# EAGLE design solar (EAGLE 9.1.3)
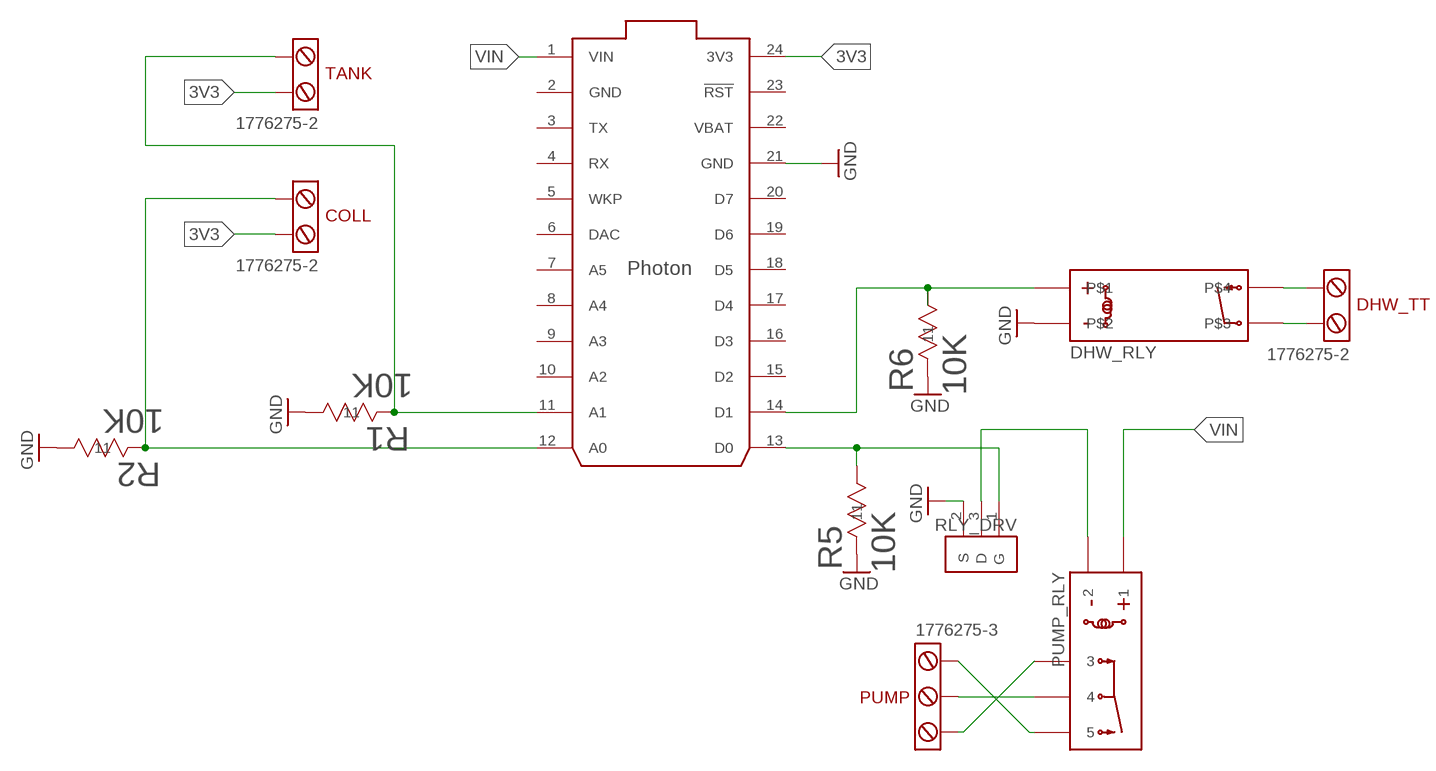
[diagram p0: schematic, sheet 1]

## Parts
COLL  1776275-2  [TERM-BLOCK-3.5MM-2]
DHW_RLY  CPC1017N  [SOP04]
DHW_TT  1776275-2  [TERM-BLOCK-3.5MM-2]
PARTICLE  PHOTON_WITH_HEADERS  [PHOTON]
PUMP  1776275-3  [TERM-BLOCK-3.5MM-3]
PUMP_RLY  PE014005  [RELAY5-PE_CO]
R1  10K  ERA-6ARW103V0805-M  [0805-M]
R2  10K  ERA-6ARW103V0805-M  [0805-M]
R5  10K  ERA-6ARW103V0805-M  [0805-M]
R6  10K  ERA-6ARW103V0805-M  [0805-M]
RLY_DRV  NTR4003N  [SOT23]
TANK  1776275-2  [TERM-BLOCK-3.5MM-2]

## Nets
3V3: COLL.P$1 PARTICLE.24(3V3) TANK.P$1
A0: COLL.P$2 PARTICLE.12(A0) R2.1
A1: PARTICLE.11(A1) R1.1 TANK.P$2
COM [5A]: PUMP.P$2 PUMP_RLY.11
D0: PARTICLE.13(D0) R5.2 RLY_DRV.1(G)
D1: DHW_RLY.P$1 PARTICLE.14(D1) R6.2
GND: DHW_RLY.P$2 PARTICLE.21(GND) R1.2 R2.2 R5.1 R6.1 RLY_DRV.2(S)
N$7: PUMP_RLY.A2 RLY_DRV.3(D)
N$8: DHW_RLY.P$4 DHW_TT.P$2
N$10: DHW_RLY.P$3 DHW_TT.P$1
NC [5A]: PUMP.P$3 PUMP_RLY.12
NO [5A]: PUMP.P$1 PUMP_RLY.14
VIN: PARTICLE.1(VIN) PUMP_RLY.A1
Unconnected: PARTICLE.3(TX) PARTICLE.4(RX) PARTICLE.5(WKP) PARTICLE.6(DAC) PARTICLE.7(A5) PARTICLE.8(A4) PARTICLE.9(A3) PARTICLE.10(A2) PARTICLE.15(D2) PARTICLE.16(D3) PARTICLE.17(D4) PARTICLE.18(D5) PARTICLE.19(D6) PARTICLE.20(D7) PARTICLE.23(!RST)

## Power pins joined to a net without a drawn wire
GND: PARTICLE.2(GND)
VBAT: PARTICLE.22(VBAT)

## Library data of the parts
COLL DHW_TT TANK = geoff:1776275-2: 3.5MM terminal block 2 pos; PN: 1776275-2
DHW_RLY = geoff:CPC1017N; PN: CPC1017N
PARTICLE = Spark:PHOTON
PUMP = geoff:1776275-3: 3.5MM terminal block 3 pos; PN: 1776275-3
PUMP_RLY = geoff:PE014005; MANUFACTURER_PART_NUMBER: PE014005; PN: PE014005; VENDOR: TE Connectivity
R1 R2 R5 R6 = geoff:ERA-6ARW103V; MANUFACTURER_PART_NUMBER: ERA6ARW103V; VENDOR: Panasonic
RLY_DRV = geoff:NTR4003N

## Net classes
0 default: width 0.508 mm
1 5A: width 2.083 mm

## Board
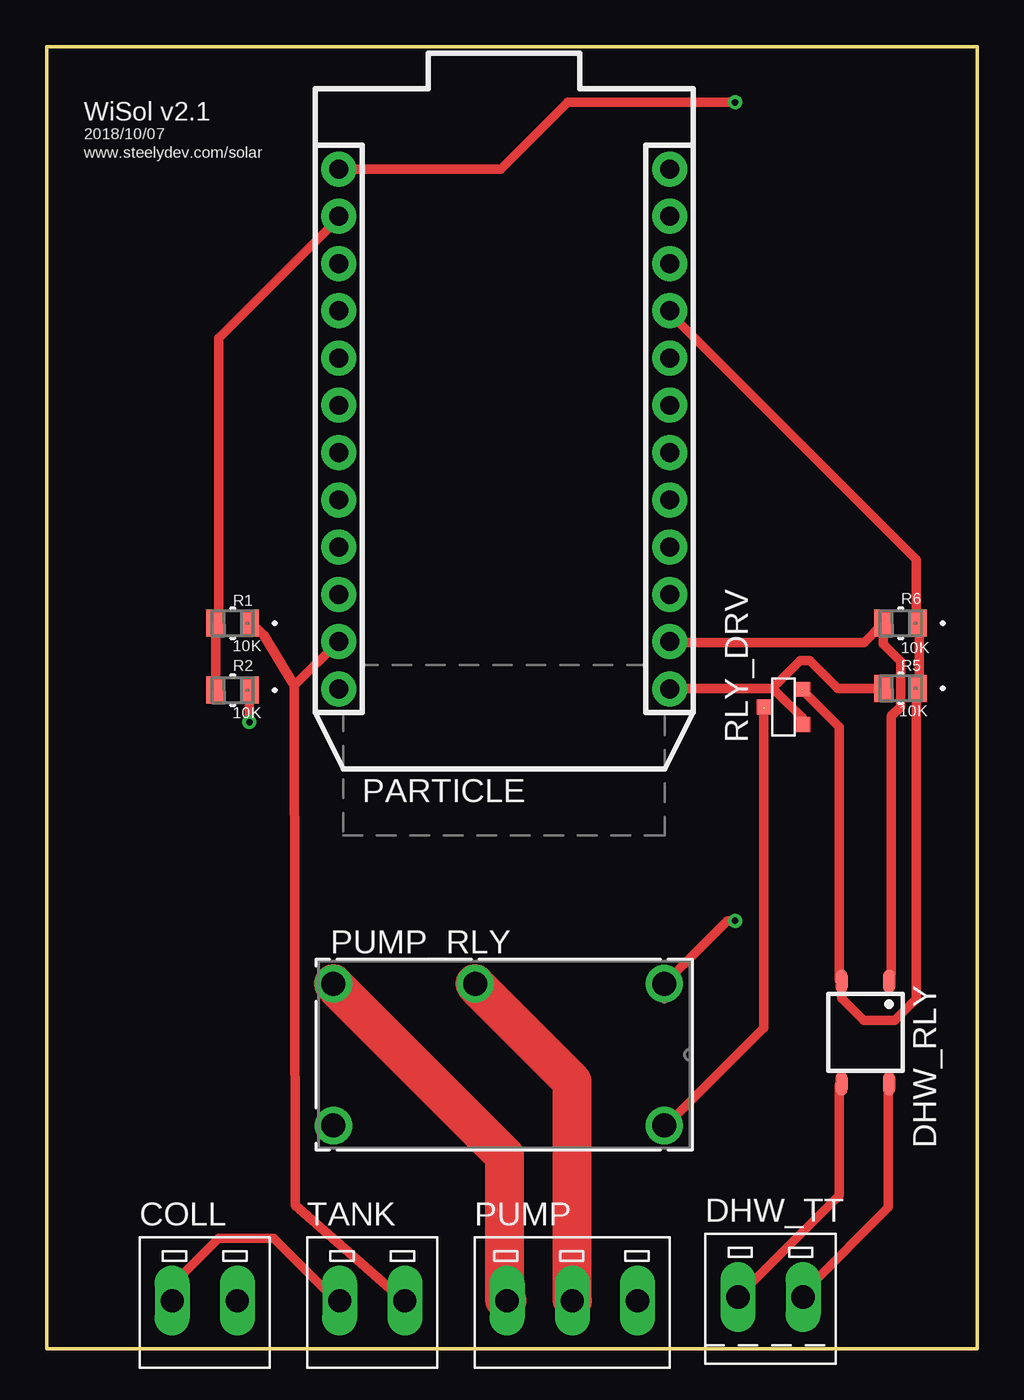
[diagram p1: board, top side]
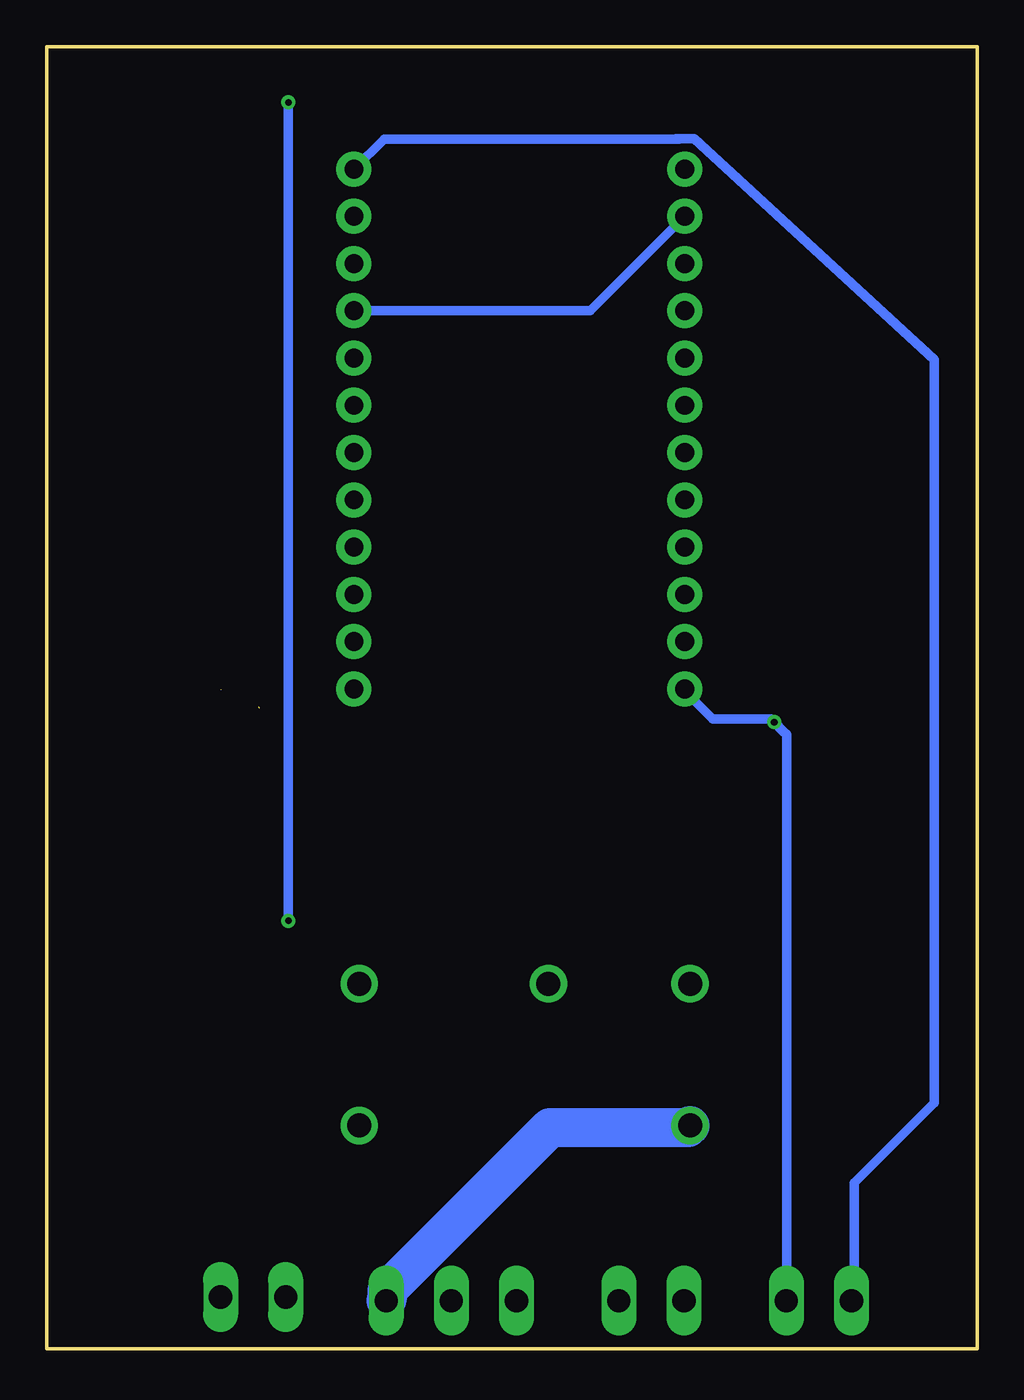
[diagram p2: board, bottom side, seen from below]

Size 50 x 70 mm. Coordinates in mm from the lower left corner, seen from the top.
Outline: 0,0 1,0 49,0 50,0 50,70 49,70 1,70 0,70 0,0
Copper layers (1*16): Top 0.035mm / dielectric 1.5mm / Bottom 0.035mm
Design rules "default": minimum track width 6mil, minimum drill 0.35mm, track to track 6mil, track to pad 6mil, pad to pad 6mil, via to via 6mil, smd to smd 6mil, copper to edge 40mil, drill to drill 6mil, minimum pad ring 10mil, minimum via ring 8mil, stop-mask expansion 4mil, vias tented up to drill 0mil, thermal gap 10mil

### Footprints (pad centres in the part's own frame; a part is rotated, then mirrored left to right if it is on the bottom)
TERM-BLOCK-3.5MM-2 = drill 1.25 long: P$1 1.75,3.585; P$2 5.25,3.585
SOP04 = smd 0.635 x 1.27: P$1 -1.27,-2.75; P$2 1.27,-2.75; P$3 1.27,2.75; P$4 -1.27,2.75
PHOTON = drill 1.016 pad 1.88: 1 -0.001,27.932; 2 -0.001,25.392; 3 -0.001,22.852; 4 -0.001,20.312; 5 -0.001,17.772; 6 -0.001,15.232; 7 -0.001,12.692; 8 -0.001,10.152; 9 -0.001,7.612; 10 -0.001,5.072; 11 -0.001,2.532; 12 -0.001,-0.008; 13 17.779,-0.008; 14 17.779,2.532; 15 17.779,5.072; 16 17.779,7.612; 17 17.779,10.152; 18 17.779,12.692; 19 17.779,15.232; 20 17.779,17.772; 21 17.779,20.312; 22 17.779,22.852; 23 17.779,25.392; 24 17.779,27.932
TERM-BLOCK-3.5MM-3 = drill 1.25 long: P$1 1.75,3.585; P$2 5.25,3.585; P$3 8.75,3.585
RELAY5-PE_CO = drill 1.295 pad 2.007: 11 -7.62,7.036; 12 0,-0.584; 14 -7.62,-0.584; A1 -7.62,17.196; A2 0,17.196
0805-M = smd 0.965 x 1.448: 1 -0.927,0; 2 0.927,0
SOT23 = smd 0.8 x 0.9: 1 -0.95,-1; 2 0.95,-1; 3 0,1

### Placement (x,y rotation side)
COLL  5,-1 0 top
DHW_RLY  44,17 180 top
DHW_TT  35.4,-0.8 0 top
PARTICLE  15.7,35.48 0 top
PUMP  23,-1 0 top
PUMP_RLY  16,12 270 top
R1  10,39 180 top
R2  10,35.4 180 top
R5  45.9,35.5 180 top
R6  45.9,39 180 top
RLY_DRV  39.6,34.5 90 top
TANK  14,-1 0 top

### Tracks (layer width: path | path; a pad name or v marks a point on that pad's centre or on a via)
3V3
  Top 0.508: COLL.P$1 7.05,3.75 9.25,5.94 12.21,5.94 15.54,2.61 15.68,2.64 TANK.P$1
  Bottom 0.508: PARTICLE.24 31.85,65.03 16,65.03 16.18,65.05 15.19,65.05 2.3,53.16 2.3,13.21 2.31,13.21 6.6,8.91 6.6,2.63 COLL.P$1
A0  (via drill 0.35)
  Top 0.508: v10.9,33.68 10.9,35.33 R2.1
  Bottom 0.508: COLL.P$2 10.24,2.63 10.24,33.02 10.4,33.19 v10.9,33.68 11.06,33.85 14.2,33.85 15.68,35.33 PARTICLE.12
A1
  Top 0.508: 13.32,35.64 13.35,7.71 19.15,2.63 19.32,2.64 TANK.P$2 | 13.32,35.64 PARTICLE.11 | 13.32,35.64 11.67,38.36 11.15,38.88 11.06,38.87 R1.1
COM
  Top 2.083: PUMP.P$2 28.23,2.64 28.23,14.36 23.11,19.48 PUMP_RLY.11
D0
  Top 0.508: R5.2 44.91,35.5 43,35.5 42.5,35.5 41,37 40.5,37 39,35.5 | 39,35.5 38,35.5 33.52,35.5 PARTICLE.13 | 39,35.5 39.19,35.31 39.22,35.31 40.6,33.92 RLY_DRV.1
D1
  Top 0.508: 45.24,19.65 DHW_RLY.P$1 | 45.24,19.98 DHW_RLY.P$1 | PARTICLE.14 33.52,37.97 43.95,37.97 R6.2 44.97,37.87 45.9,36.95 45.9,34.51 45.4,34.01 45.4,20.14 45.24,19.98 | 45.24,19.98 DHW_RLY.P$1
GND  (1 unrouted)
  Top 0.508: 40.61,35.41 42.6,33.42 42.6,19.81 DHW_RLY.P$2 42.73,18.84 43.92,17.66 45.57,17.66 46.72,18.81 46.72,35.33 R5.1 46.89,35.66 46.89,38.97 R6.1 46.72,39.14 46.72,42.43 33.52,55.64 PARTICLE.21 | R2.2 9.08,35.5 9.08,38.97 R1.2 9.25,39.14 9.25,54.32 15.68,60.76 PARTICLE.2
  Bottom 0.508: 15.42,60.8 15.42,60.86 15.52,60.92 PARTICLE.2 20.78,55.79 PARTICLE.21 33.35,55.8
N$7  (1 unrouted)
  Top 0.508: 38.55,34.41 38.55,17.25 33.35,12.05 PUMP_RLY.A2
N$8
  Top 0.508: DHW_RLY.P$4 45.24,14.2 45.24,7.59 40.9,3.26 DHW_TT.P$2
N$10
  Top 0.508: DHW_RLY.P$3 42.6,14.2 42.6,8.26 37.16,2.82 DHW_TT.P$1
NC
  Bottom 2.083: PUMP.P$3 31.7,2.64 31.7,3.14 22.95,11.89 15.52,11.89 PUMP_RLY.12
NO
  Top 2.083: PUMP.P$1 24.6,2.64 24.6,10.4 15.52,19.48 PUMP_RLY.14
VIN  (via drill 0.35)
  Top 0.508: PARTICLE.1 24.41,63.41 28,67 32.03,67 v37,67 | PUMP_RLY.A1 36.58,23 v37,23
  Bottom 0.508: v37,67 v37,23

### Text on the board
tNames: WiSol v2.1 | 2018/10/07 | www.steelydev.com/solar